# Altium schematic sheet Raspberry Pi 5.SchDoc
size A; SheetNumber: 1; SheetTotal: 1
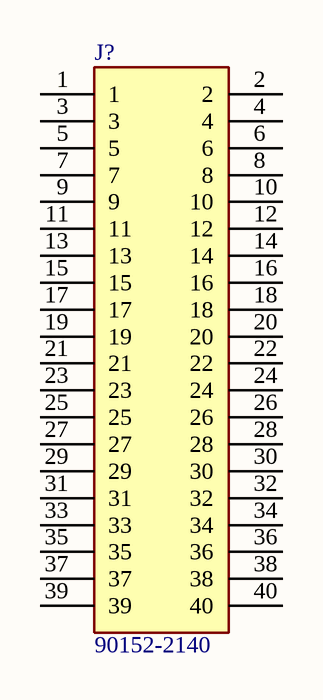
[diagram p0: Raspberry Pi 5.SchDoc]

## Parts
J?  90152-2140  [901522140]

## Nets

Not connected (* = marked no-connect by the designer): J? 1 2 3 4 5 6 7 8 9 10 11 12 13 14 15 16 17 18 19 20 21 22 23 24 25 26 27 28 29 30 31 32 33 34 35 36 37 38 39 40

## Library data of the parts
J? = 90152-2140: Connector; Manufacturer_Name: Molex; Datasheet Link: https://componentsearchengine.com/Datasheets/1/90152-2140.pdf; Height: 6.04mm; Manufacturer_Part_Number: 90152-2140; Mouser Part Number: 538-90152-2140; Mouser Price/Stock: https://www.mouser.co.uk/ProductDetail/Molex/90152-2140?qs=WjPO6T6WDwtFvwOIKRG5Yg%3D%3D